# EAGLE design FdbkCtrl_v01 (EAGLE 8.2.1)

## Sheet 1 of 2
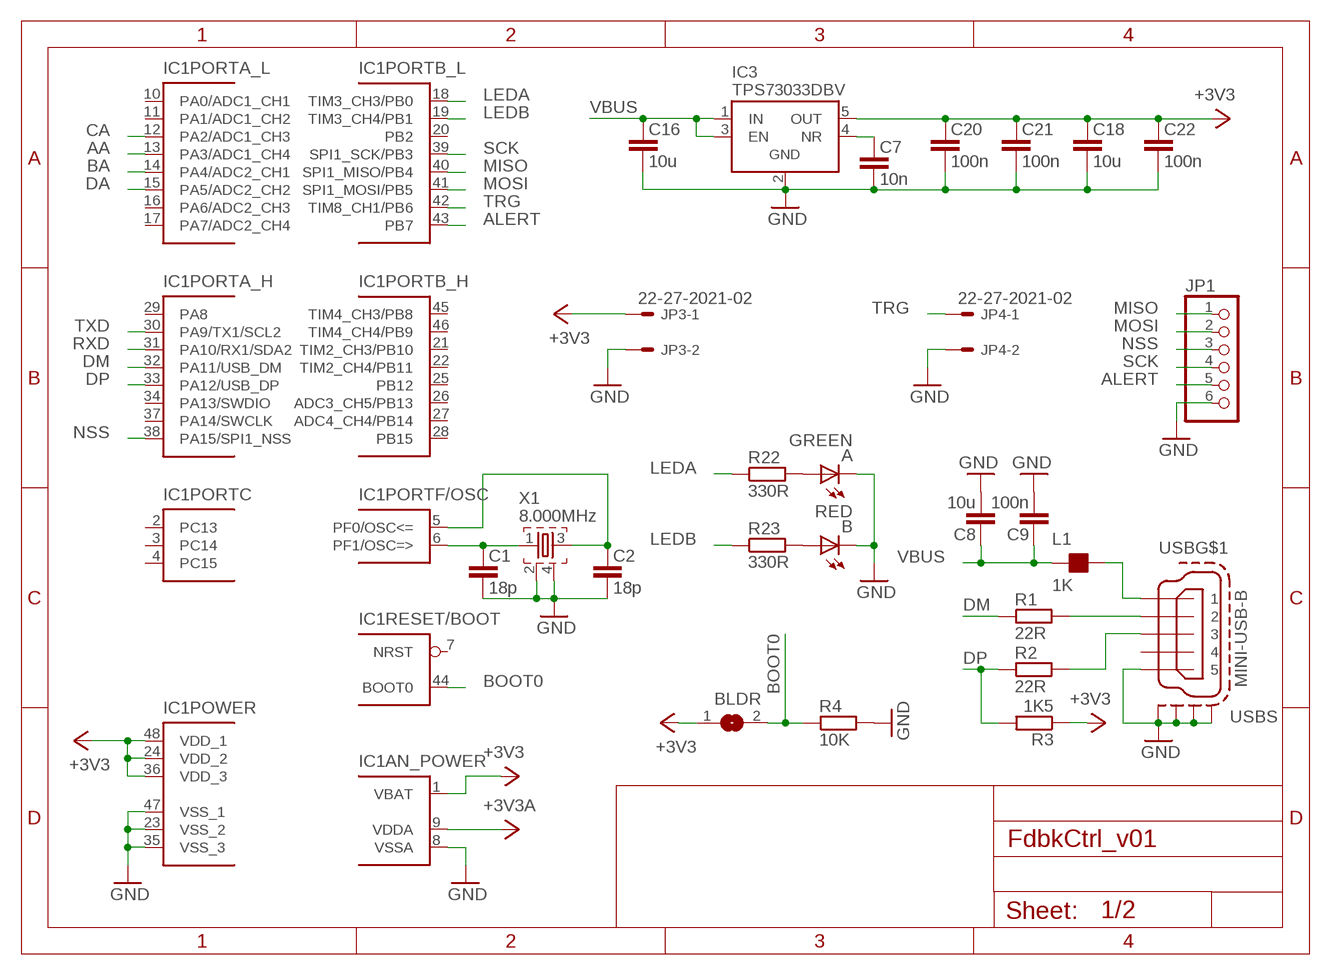
[diagram p0: schematic, sheet 1]

### Parts
A  GREEN  LEDCHIPLED_0805  [CHIPLED_0805]
B  RED  LEDCHIPLED_0805  [CHIPLED_0805]
BLDR  SJ  [SJ]
C1  18p  C_EU_C0603G  [C0603G]
C2  18p  C_EU_C0603G  [C0603G]
C7  10n  C_EU_C0402G  [C0402G]
C8  10u  C_EU_C0805G  [C0805G]
C9  100n  C_EU_C0603G  [C0603G]
C16  10u  C_EU_C0805G  [C0805G]
C18  10u  C_EU_C0805G  [C0805G]
C20  100n  C_EU_C0402G  [C0402G]
C21  100n  C_EU_C0402G  [C0402G]
C22  100n  C_EU_C0402G  [C0402G]
IC1  STM32F303CXT6  [LQFP48]
IC3  TPS73033DBV  [SOT23-5]
JP1  PINHD-1X6  [1X06]
JP3  22-27-2021-02  [6410-02]
JP4  22-27-2021-02  [6410-02]
L1  1K  FB_0603  [L0603]
R1  22R  R_EU_R0603  [R0603]
R2  22R  R_EU_R0603  [R0603]
R3  1K5  R_EU_R0603  [R0603]
R4  10K  R_EU_R0603G  [R0603G]
R22  330R  R_EU_R0603  [R0603]
R23  330R  R_EU_R0603  [R0603]
USB  MINI-USB-B  MINI-USB-SCHIELD-32005-201  [32005-201]
X1  8.000MHz  ABMM2  [ABMM2]

### Nets
+3V3: BLDR.1 C18.1 C20.1 C21.1 C22.1 IC1.1(AN_POWER:VBAT) IC1.24(POWER:VDD_2) IC1.36(POWER:VDD_3) IC1.48(POWER:VDD_1) IC3.5(OUT) JP3.1 R3.1
+3V3A: IC1.9(AN_POWER:VDDA) ; also sheet 2
AA: IC1.13(PORTA_L:PA3/ADC1_CH4) ; also sheet 2
ALERT: IC1.43(PORTB_L:PB7) JP1.5
BA: IC1.14(PORTA_L:PA4/ADC2_CH1) ; also sheet 2
BOOT0: BLDR.2 IC1.44(RESET/BOOT:BOOT0) R4.1
CA: IC1.12(PORTA_L:PA2/ADC1_CH3) ; also sheet 2
DA: IC1.15(PORTA_L:PA5/ADC2_CH2) ; also sheet 2
DM: IC1.32(PORTA_H:PA11/USB_DM) R1.1
DP: IC1.33(PORTA_H:PA12/USB_DP) R2.1 R3.2
GND: A.C B.C C1.2 C2.2 C7.2 C8.2 C9.2 C16.2 C18.2 C20.2 C21.2 C22.2 IC1.8(AN_POWER:VSSA) IC1.23(POWER:VSS_2) IC1.35(POWER:VSS_3) IC1.47(POWER:VSS_1) IC3.2(GND) JP1.6 JP3.2 JP4.2 R4.2 USB.5 USB.M1(S:S1) USB.M2(S:S2) USB.M3(S:S3) USB.M4(S:S4) X1.2 X1.4 ; also sheet 2
LEDA: IC1.18(PORTB_L:TIM3_CH3/PB0) R22.1
LEDB: IC1.19(PORTB_L:TIM3_CH4/PB1) R23.1
MISO: IC1.40(PORTB_L:SPI1_MISO/PB4) JP1.1
MOSI: IC1.41(PORTB_L:SPI1_MOSI/PB5) JP1.2
N$1: C1.1 IC1.6(PORTF/OSC:PF1/OSC=>) X1.1
N$2: C2.1 IC1.5(PORTF/OSC:PF0/OSC<=) X1.3
N$4: L1.2 USB.1
N$5: R1.2 USB.2
N$6: R2.2 USB.3
N$19: A.A R22.2
N$20: C7.1 IC3.4(NR)
N$21: B.A R23.2
NSS: IC1.38(PORTA_H:PA15/SPI1_NSS) JP1.3
RXD: IC1.31(PORTA_H:PA10/RX1/SDA2)
SCK: IC1.39(PORTB_L:SPI1_SCK/PB3) JP1.4
TRG: IC1.42(PORTB_L:TIM8_CH1/PB6) JP4.1
TXD: IC1.30(PORTA_H:PA9/TX1/SCL2)
VBUS: C8.1 C9.1 C16.1 IC3.1(IN) IC3.3(EN) L1.1 ; also sheet 2
Unconnected: IC1.2(PORTC:PC13) IC1.3(PORTC:PC14) IC1.4(PORTC:PC15) IC1.7(RESET/BOOT:NRST) IC1.10(PORTA_L:PA0/ADC1_CH1) IC1.11(PORTA_L:PA1/ADC1_CH2) IC1.16(PORTA_L:PA6/ADC2_CH3) IC1.17(PORTA_L:PA7/ADC2_CH4) IC1.20(PORTB_L:PB2) IC1.21(PORTB_H:TIM2_CH3/PB10) IC1.22(PORTB_H:TIM2_CH4/PB11) IC1.25(PORTB_H:PB12) IC1.26(PORTB_H:ADC3_CH5/PB13) IC1.27(PORTB_H:ADC4_CH4/PB14) IC1.28(PORTB_H:PB15) IC1.29(PORTA_H:PA8) IC1.34(PORTA_H:PA13/SWDIO) IC1.37(PORTA_H:PA14/SWCLK) IC1.45(PORTB_H:TIM4_CH3/PB8) IC1.46(PORTB_H:TIM4_CH4/PB9) USB.4

## Sheet 2 of 2
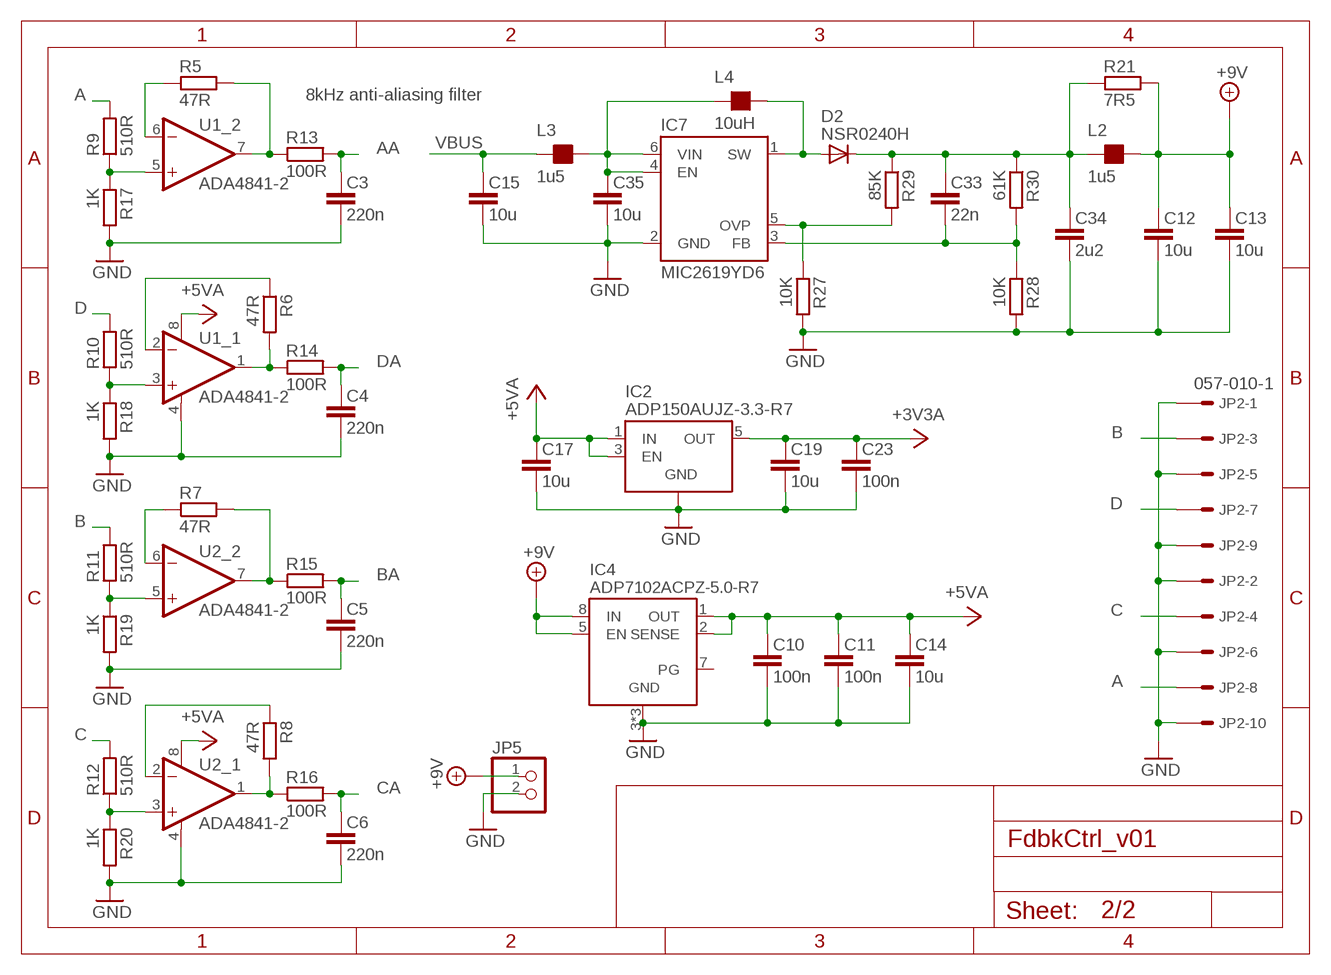
[diagram p1: schematic, sheet 2]

### Parts
C3  220n  C_EU_C0603G  [C0603G]
C4  220n  C_EU_C0603G  [C0603G]
C5  220n  C_EU_C0603G  [C0603G]
C6  220n  C_EU_C0603G  [C0603G]
C10  100n  C_EU_C0603G  [C0603G]
C11  100n  C_EU_C0603G  [C0603G]
C12  10u  C_EU_C0805G  [C0805G]
C13  10u  C_EU_C0805G  [C0805G]
C14  10u  C_EU_C0805G  [C0805G]
C15  10u  C_EU_C0805G  [C0805G]
C17  10u  C_EU_C0805G  [C0805G]
C19  10u  C_EU_C0805G  [C0805G]
C23  100n  C_EU_C0402G  [C0402G]
C33  22n  C_EU_C0603  [C0603]
C34  2u2  C_EU_C0805G  [C0805G]
C35  10u  C_EU_C0805G  [C0805G]
D2  NSR0240H  [SOD323]
IC2  ADP150AUJZ-3.3-R7  [SOT23-5]
IC4  ADP7102ACPZ-5.0-R7  [LFCSP8]
IC7  MIC2619YD6  [SOT23-6]
JP2  057-010-1  [057-010-1]
JP5  PINHD-1X2  [1X02]
L2  1u5  FB_2010  [L2010]
L3  1u5  FB_2010  [L2010]
L4  10uH  FB_1210  [L1210]
R5  47R  R_EU_R0603  [R0603]
R6  47R  R_EU_R0603  [R0603]
R7  47R  R_EU_R0603  [R0603]
R8  47R  R_EU_R0603  [R0603]
R9  510R  R_EU_R0603  [R0603]
R10  510R  R_EU_R0603  [R0603]
R11  510R  R_EU_R0603  [R0603]
R12  510R  R_EU_R0603  [R0603]
R13  100R  R_EU_R0603  [R0603]
R14  100R  R_EU_R0603  [R0603]
R15  100R  R_EU_R0603  [R0603]
R16  100R  R_EU_R0603  [R0603]
R17  1K  R_EU_R0603G  [R0603G]
R18  1K  R_EU_R0603G  [R0603G]
R19  1K  R_EU_R0603G  [R0603G]
R20  1K  R_EU_R0603G  [R0603G]
R21  7R5  R_EU_R0805  [R0805]
R27  10K  R_EU_R0603G  [R0603G]
R28  10K  R_EU_R0603G  [R0603G]
R29  85K  R_EU_R0603  [R0603]
R30  61K  R_EU_R0603  [R0603]
U1  ADA4841-2  [SOIC-8]
U2  ADA4841-2  [SOIC-8]

### Nets
+3V3A: C19.1 C23.1 IC2.5(OUT) ; also sheet 1
+5VA: C10.1 C11.1 C14.1 C17.1 IC2.1(IN) IC2.3(EN) IC4.1(OUT) IC4.2(SENSE) U1.8(_1:V+) U2.8(_1:V+)
+9V: C12.1 C13.1 IC4.5(EN) IC4.8(IN) JP5.1 L2.2 R21.2
+9VRAW: C33.1 C34.1 D2.C L2.1 R21.1 R29.1 R30.1
A: JP2.8 R9.2
AA: C3.1 R13.2 ; also sheet 1
B: JP2.3 R11.2
BA: C5.1 R15.2 ; also sheet 1
C: JP2.4 R12.2
CA: C6.1 R16.2 ; also sheet 1
D: JP2.7 R10.2
DA: C4.1 R14.2 ; also sheet 1
FB: C33.2 IC7.3(FB) R28.1 R30.2
GND: C3.2 C4.2 C5.2 C6.2 C10.2 C11.2 C12.2 C13.2 C14.2 C15.2 C17.2 C19.2 C23.2 C34.2 C35.2 IC2.2(GND) IC4.3(GND) IC4.6(GND) IC4.EP(GND) IC7.2(GND) JP2.1 JP2.2 JP2.5 JP2.6 JP2.9 JP2.10 JP5.2 R17.2 R18.2 R19.2 R20.2 R27.2 R28.2 U1.4(_1:V-) U2.4(_1:V-) ; also sheet 1
N$3: R5.2 R13.1 U1.7(_2:OUT)
N$7: R6.2 R14.1 U1.1(_1:OUT)
N$8: R7.2 R15.1 U2.7(_2:OUT)
N$9: R8.2 R16.1 U2.1(_1:OUT)
N$10: R10.1 R18.1 U1.3(_1:+IN)
N$11: R11.1 R19.1 U2.5(_2:+IN)
N$12: R12.1 R20.1 U2.3(_1:+IN)
N$13: R5.1 U1.6(_2:-IN)
N$14: R7.1 U2.6(_2:-IN)
N$15: R8.1 U2.2(_1:-IN)
N$16: R6.1 U1.2(_1:-IN)
N$17: R9.1 R17.1 U1.5(_2:+IN)
OVP: IC7.5(OVP) R27.1 R29.2
SW: D2.A IC7.1(SW) L4.2
VBUS: C15.1 L3.1 ; also sheet 1
VIN: C35.1 IC7.4(EN) IC7.6(VIN) L3.2 L4.1
Unconnected: IC4.7(PG)

### Notes on the sheet
- 8kHz anti-aliasing filter

## Library data of the parts
A B = SmartMDC:LED
BLDR = SmartMDC:SJ: SMD solder JUMPER
C1-C23 C33-C35 = SmartMDC:C_EU_
D2 = SmartMDC:NSR0240H
IC1 = SmartMDC:STM32F303CXT6: ST STM32F101/103 48pin LQFP
IC2 = SmartMDC:ADP150*: ANALOG DEVICES Ultralow Noise, 150 mA CMOS Linear Regulator
IC3 = SmartMDC:TPS730*: TEXAS INSTRUMENTS Low-Noise, High PSRR, RF, 200-mA Low-Dropout Linear Regulators
IC4 = SmartMDC:ADP7102*: ANALOG DEVICES 20 V, 300 mA, Low Noise, CMOS LDO
IC7 = SmartMDC:MIC2619
JP1 = SmartMDC:PINHD-1X6: PIN HEADER
JP2 = con-panduit:057-010-: CONNECTOR 10-pin series 057 contact pc board low profile headers; OC_FARNELL: unknown; OC_NEWARK: unknown
JP3 JP4 = SmartMDC:22-?-02: CONNECTOR wire to board 2.54 mm (.1 inch) pitch header; OC_FARNELL: unknown; OC_NEWARK: unknown
JP5 = SmartMDC:PINHD-1X2: PIN HEADER
L1-L4 = SmartMDC:FB_: FERRITE BEAD
R1-R23 R27-R30 = SmartMDC:R_EU_
U1 U2 = SmartMDC:ADA4841
USB = SmartMDC:MINI-USB-SCHIELD-: MINI USB-B Conector Source: www.cypressindustries.com; OC_FARNELL: unknown; OC_NEWARK: unknown
X1 = SmartMDC:ABM

## Board
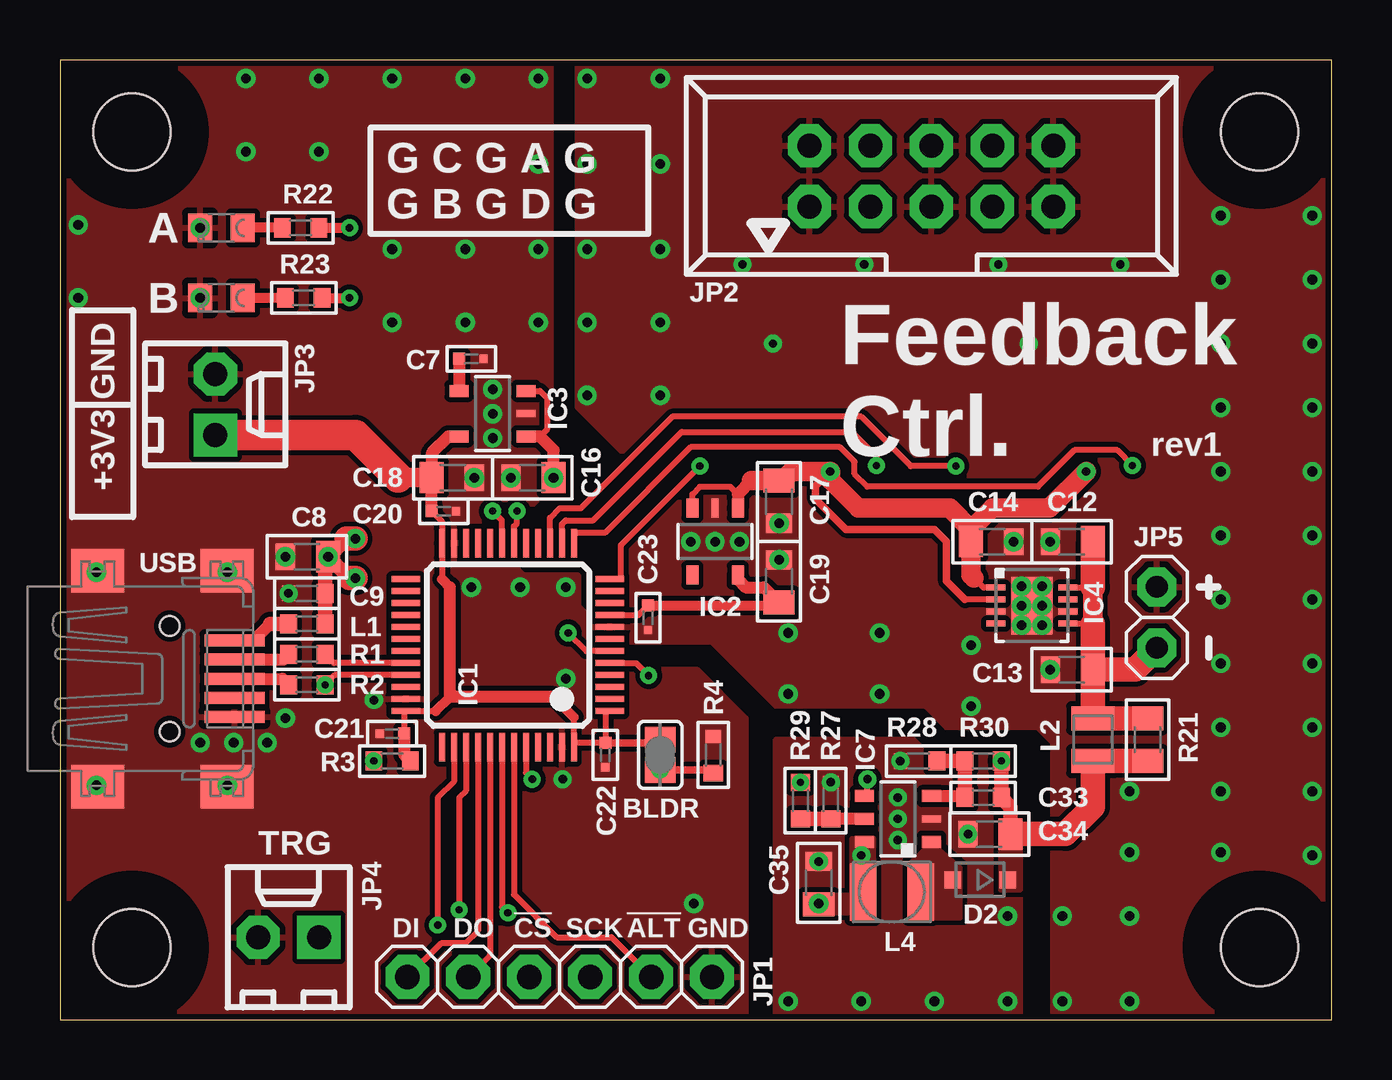
[diagram p2: board, top side]
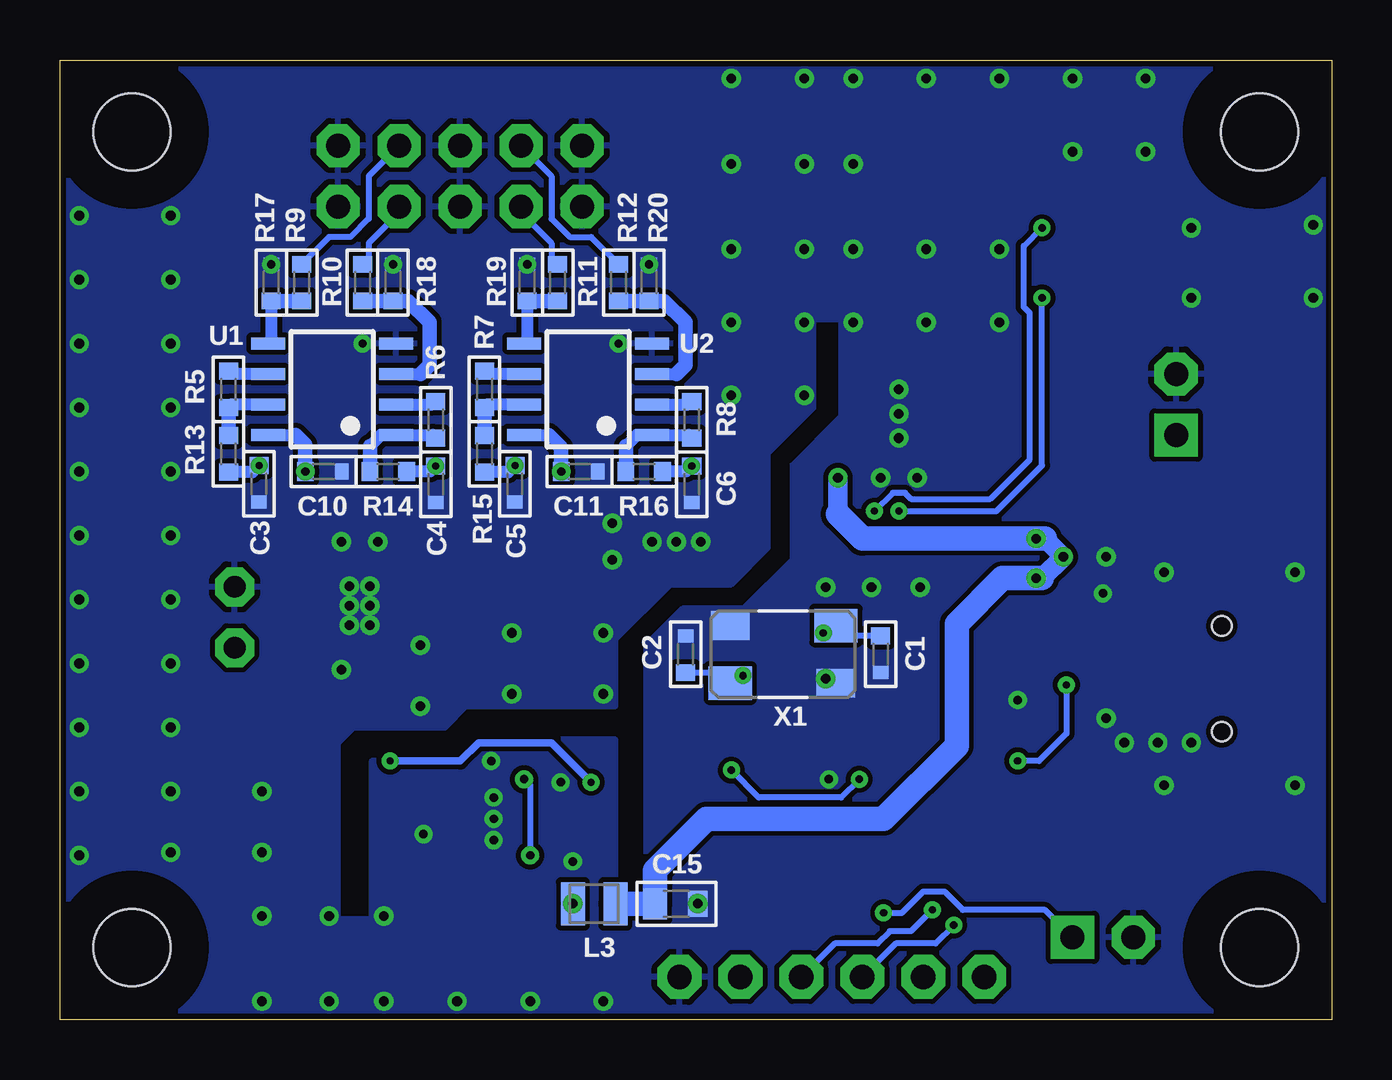
[diagram p3: board, bottom side, seen from below]

Size 53 x 40 mm. Coordinates in mm from the lower left corner, seen from the top.
Outline: 0,0 53,0 53,40 0,40 0,0
Copper layers (1*16): Top 0.035mm / dielectric 1.5mm / Bottom 0.035mm
Design rules "default *": minimum track width 8mil, minimum drill 0.3mm, track to track 8mil, track to pad 8mil, pad to pad 8mil, via to via 8mil, smd to smd 0mil, copper to edge 10mil, drill to drill 6mil, minimum pad ring 10mil, minimum via ring 8mil, stop-mask expansion 4mil, vias tented up to drill 24mil, thermal gap 10mil
Holes 3.2 mm at 3,3 50,3 3,37 50,37
tRestrict: area 0,34 to 6,40; area 0,0 to 6,6; area 47,0 to 53,6; area 47,34 to 53,40
bRestrict: area 47,34 to 53,40; area 0,34 to 6,40; area 0,0 to 6,6; area 47,0 to 53,6

### Footprints (pad centres in the part's own frame; a part is rotated, then mirrored left to right if it is on the bottom)
CHIPLED_0805 = smd 1.2 x 1: A 0,-0.889; C 0,0.889
SJ = smd 1.067 x 1.27: 1 -0.635,0; 2 0.635,0
C0603G = smd 0.7 x 0.8: 1 -0.762,0 | smd 0.548 x 0.648: 2 0.762,0
C0402G = smd 0.5 x 0.5: 1 -0.508,0 | smd 0.348 x 0.348: 2 0.508,0
C0805G = smd 1 x 1.3: 1 -0.889,0 | smd 0.797 x 1.097: 2 0.889,0
C0603 = smd 0.7 x 0.8: 1 -0.762,0; 2 0.762,0
SOD323 = smd 0.7 x 0.7: A 1.143,0; C -1.143,0
LQFP48 = smd 0.25 x 1.2: 1 -2.75,-4.25; 2 -2.25,-4.25; 3 -1.75,-4.25; 4 -1.25,-4.25; 5 -0.75,-4.25; 6 -0.25,-4.25; 7 0.25,-4.25; 8 0.75,-4.25; 9 1.25,-4.25; 10 1.75,-4.25; 11 2.25,-4.25; 12 2.75,-4.25; 25 2.75,4.25; 26 2.25,4.25; 27 1.75,4.25; 28 1.25,4.25; 29 0.75,4.25; 30 0.25,4.25; 31 -0.25,4.25; 32 -0.75,4.25; 33 -1.25,4.25; 34 -1.75,4.25; 35 -2.25,4.25; 36 -2.75,4.25 | smd 1.2 x 0.25: 13 4.25,-2.75; 14 4.25,-2.25; 15 4.25,-1.75; 16 4.25,-1.25; 17 4.25,-0.75; 18 4.25,-0.25; 19 4.25,0.25; 20 4.25,0.75; 21 4.25,1.25; 22 4.25,1.75; 23 4.25,2.25; 24 4.25,2.75; 37 -4.25,2.75; 38 -4.25,2.25; 39 -4.25,1.75; 40 -4.25,1.25; 41 -4.25,0.75; 42 -4.25,0.25; 43 -4.25,-0.25; 44 -4.25,-0.75; 45 -4.25,-1.25; 46 -4.25,-1.75; 47 -4.25,-2.25; 48 -4.25,-2.75
SOT23-5 = smd 0.5 x 0.8: 1 -0.95,-1.397; 3 0.95,-1.397; 4 0.95,1.397; 5 -0.95,1.397 | smd 0.297 x 0.8: 2 0,-1.397
LFCSP8 = smd 0.25 x 0.8: 1 -0.75,-1.5; 2 -0.25,-1.5; 3 0.25,-1.5; 4 0.75,-1.5; 5 0.75,1.5; 6 0.25,1.5; 7 -0.25,1.5; 8 -0.75,1.5 | smd 2.4 x 1.7: EP 0,0
SOT23-6 = smd 0.5 x 0.8: 1 -0.95,-1.397; 3 0.95,-1.397; 4 0.95,1.397; 5 0,1.397; 6 -0.95,1.397 | smd 0.297 x 0.8: 2 0,-1.397
1X06 = drill 1.016 octagon: 1 -6.35,0; 2 -3.81,0; 3 -1.27,0; 4 1.27,0; 5 3.81,0; 6 6.35,0
057-010-1 = drill 1 octagon: 1 -5.08,-1.27; 2 -5.08,1.27; 3 -2.54,-1.27; 4 -2.54,1.27; 5 0,-1.27; 6 0,1.27; 7 2.54,-1.27; 8 2.54,1.27; 9 5.08,-1.27; 10 5.08,1.27
6410-02 = drill 1 square: 1 1.27,0 | drill 1 octagon: 2 -1.27,0
1X02 = drill 0.9 octagon: 1 -1.27,0; 2 1.27,0
L0603 = smd 0.7 x 0.8: 1 -0.762,0; 2 0.762,0
L2010 = smd 1 x 1.8: 1 -0.889,0; 2 0.889,0
L1210 = smd 1.1 x 2.4: 1 -1.2,0; 2 1.2,0
R0603 = smd 0.7 x 0.8: 1 -0.762,0; 2 0.762,0
R0603G = smd 0.7 x 0.8: 1 -0.762,0 | smd 0.548 x 0.648: 2 0.762,0
R0805 = smd 1 x 1.3: 1 -0.889,0; 2 0.889,0
SOIC-8 = smd 0.5 x 1.4: 1 -1.905,-2.667; 2 -0.635,-2.667; 3 0.635,-2.667; 4 1.905,-2.667; 5 1.905,2.667; 6 0.635,2.667; 7 -0.635,2.667; 8 -1.905,2.667
32005-201 = smd 2.5 x 0.5: 1 2.7,1.6; 2 2.7,0.8; 3 2.7,0; 4 2.7,-0.8; 5 2.7,-1.6 | smd 2.2 x 1.8: M1 -3,-4.5; M2 -3,4.5; M3 2.4,4.5; M4 2.4,-4.5 | hole 0.8: 0,2.2; 0,-2.2
ABMM2 = smd 1.8 x 1.4: 1 -2.2,-1.2; 3 2.2,1.2 | smd 1.597 x 1.197: 2 2.2,-1.2; 4 -2.2,1.2

### Placement (x,y rotation side)
A  6.73,33 90 top
B  6.73,30.08 90 top
BLDR  25.02,11.03 270 top
C1  18.8,15.22 270 bottom
C2  26.92,15.22 90 bottom
C3  44.7,22.34 270 bottom
C4  37.34,22.31 270 bottom
C5  34.04,22.34 270 bottom
C6  26.67,22.31 270 bottom
C7  17.14,27.54 0 top
C8  10.29,19.29 180 top
C9  10.29,17.76 180 top
C10  42.01,22.84 0 bottom
C11  31.34,22.84 0 bottom
C12  42.16,19.92 180 top
C13  42.16,14.59 180 top
C14  38.86,19.92 0 top
C15  27.3,4.83 0 bottom
C16  19.68,22.59 180 top
C17  29.97,21.57 270 top
C18  16.38,22.59 0 top
C19  29.97,18.27 90 top
C20  16,21.19 0 top
C21  13.84,11.92 180 top
C22  22.73,11.03 270 top
C23  24.51,16.75 270 top
C33  38.48,9.26 180 top
C34  38.73,7.73 180 top
C35  31.62,5.7 90 top
D2  38.35,5.83 180 top
IC1  18.67,15.61 90 top
IC2  27.3,19.92 180 top
IC3  18.03,25.26 90 top
IC4  40.51,17.26 270 top
IC7  34.92,8.37 90 top
JP1  20.83,1.78 0 top
JP2  36.32,35.16 0 top
JP3  6.48,25.64 270 top
JP4  9.53,3.43 0 top
JP5  45.72,16.76 90 top
L1  10.29,16.49 180 top
L2  43.05,11.67 90 top
L3  30.73,4.83 180 bottom
L4  34.67,5.32 0 top
R1  10.29,15.22 180 top
R2  10.29,13.95 180 top
R3  13.84,10.78 180 top
R4  27.23,11.03 90 top
R5  45.97,26.27 270 bottom
R6  37.34,25 270 bottom
R7  35.31,26.27 270 bottom
R8  26.67,25 270 bottom
R9  42.93,30.72 90 bottom
R10  40.39,30.72 90 bottom
R11  32.26,30.72 90 bottom
R12  29.72,30.72 90 bottom
R13  45.97,23.58 270 bottom
R14  39.32,22.84 0 bottom
R15  35.31,23.58 270 bottom
R16  28.65,22.84 0 bottom
R17  44.2,30.72 90 bottom
R18  39.12,30.72 90 bottom
R19  33.53,30.72 90 bottom
R20  28.45,30.72 90 bottom
R21  45.34,11.67 90 top
R22  10.03,33 180 top
R23  10.16,30.08 180 top
R27  32.13,9.13 90 top
R28  35.79,10.78 180 top
R29  30.86,9.13 270 top
R30  38.48,10.78 180 top
U1  41.66,26.27 90 bottom
U2  30.99,26.27 90 bottom
USB  4.57,14.21 0 top
X1  22.86,15.22 180 bottom

### Tracks (layer width: path | path; a pad name or v marks a point on that pad's centre or on a via)
+3V3
  Top 0.254: C21.1 14.35,12.86 IC1.36 15.66,12.86 | IC1.1 22.73,12.86 C22.1 21.42,11.54 IC1.48 21.42,12.6 | C20.1 15.92,20.77 IC1.24 15.92,18.36
  Top 0.305: C22.1 24.89,11.54 BLDR.1
  Top 0.406: 15.92,18.36 16.26,18.02 | 15.66,12.86 16.26,13.45 | 21.42,12.6 20.57,13.45
  Top 0.508: C21.1 14.35,11.03 R3.1 | C20.1 C18.1 15.49,23.61 16.2,24.31 IC3.5 | 16.26,18.02 16.26,13.45 20.57,13.45
  Top 0.813: C18.1 14.1,22.59
  Top 1.27: JP3.1 12.32,24.37 14.1,22.59
+3V3A
  Top 0.254: IC1.9 24.11,16.86 C23.1
  Top 0.406: C23.1 29.84,17.26 C19.1
  Top 0.508: IC2.5 28.25,18.34 28.57,18.02 29.34,18.02 C19.1
+5VA  (via drill 0.35)
  Top 0.254: IC4.1 38.49,18.01 38.1,18.4 | IC4.2 37.72,17.51 | IC2.3 26.36,21.89 26.67,22.21 27.93,22.21 28.25,21.89
  Top 0.305: 37.72,17.51 36.96,18.27 36.96,19.92 36.45,20.43 32.77,20.43 31.5,21.7 31.5,22.23 C11.1
  Top 0.508: IC2.1 28.25,21.89 28.83,22.46
  Top 0.813: C10.1 41.25,21.32 38.86,21.32 37.97,20.43 | 38.1,18.4 37.97,18.53 C14.1 37.97,20.43 | 37.97,20.43 37.08,21.32 33.27,21.32 32.11,22.49 C11.1 30.48,22.84 30.1,22.46 C17.1 28.83,22.46
  Bottom 0.508: U2.8 32.64,24.37 | U1.8 43.18,24.37
  Bottom 0.61: 32.64,24.37 32.11,23.84 C11.1 | 43.18,24.37 42.77,23.96 C10.1
  other vias: 32.11,22.84 42.77,22.84
+9V
  Top 0.254: IC4.8 43.04,18.01 | IC4.5 43.04,16.51
  Top 0.305: 43.04,18.01 43.05,18.02 | 43.04,16.51 43.05,16.49
  Top 0.813: 43.05,16.49 43.05,18.02
  Top 1.016: 43.05,16.49 C13.1 | 43.05,18.02 C12.1 | C13.1 L2.2 R21.2 | C13.1 44.81,14.59 JP5.1
+9VRAW  (via drill 0.3)
  Top 0.61: R30.1 C33.1 39.62,8.87 C34.1
  Top 1.016: R21.1 L2.1 43.05,8.87 41.91,7.73 C34.1
  Bottom 0.305: R29.1 32.51,11.54 35.56,11.54 36.32,10.78 R30.1
  other vias: 30.86,9.89 39.24,10.78
  pour Top (isolate 0.203, no thermals): 39.22,8.29 40.03,8.29 40.03,5.39 39.22,5.39
A
  Bottom 0.254: JP2.8 40.13,35.16 40.13,33.38 40.89,32.62 41.78,32.62 R9.2
AA  (via drill 0.3)
  Top 0.254: C3.1 44.07,23.73 42.29,23.73 40.77,22.21 33.66,22.21 33.12,22.74 33.12,23.25 32.51,23.86 26.29,23.86 22.73,20.3 21.42,20.3 IC1.13
  Bottom 0.508: C3.1 44.98,22.82 R13.2
  other vias: 44.7,23.1
ALERT
  Top 0.254: IC1.43 18.92,5.21 20.7,3.43 22.99,3.43 JP1.5
B
  Bottom 0.254: JP2.3 33.78,33.64 32.51,32.37 32.51,31.73 R11.2
BA  (via drill 0.3)
  Top 0.254: IC1.14 20.92,20.65 21.08,20.81 22.23,20.81 25.91,24.5 33.02,24.5 34.04,23.48 C5.1
  Bottom 0.508: C5.1 34.31,22.82 R15.2
  other vias: 34.04,23.1
BOOT0  (via drill 0.3)
  Top 0.254: IC1.44 19.42,10.28 v19.68,10.02
  Top 0.305: BLDR.2 27.1,10.4 R4.1
  Bottom 0.254: v19.68,10.02 20.45,9.26 23.88,9.26 BLDR.2 25.04,10.4
  other vias: 25.02,10.4
C
  Bottom 0.254: JP2.4 32.51,35.16 32.51,33.38 31.75,32.62 30.86,32.62 R12.2
CA  (via drill 0.3)
  Top 0.254: IC1.12 23.37,18.36 23.37,19.77 C6.1
  Bottom 0.508: C6.1 26.9,22.84 R16.2
  other vias: 26.67,23.07
D
  Bottom 0.254: JP2.7 38.86,33.64 40.13,32.37 40.13,31.73 R10.2
DA  (via drill 0.3)
  Top 0.254: IC1.15 20.42,20.91 20.83,21.32 21.72,21.32 25.53,25.13 33.4,25.13 35.46,23.07 C4.1
  Bottom 0.508: C4.1 37.57,22.84 R14.2
  other vias: 37.34,23.07
DM
  Top 0.254: IC1.32 11.42,14.86 R1.1
DP  (via drill 0.3)
  Top 0.254: IC1.33 11.45,14.36 R2.1
  Bottom 0.254: R2.1 11.05,11.92 12.19,10.78 R3.2
  other vias: 13.08,10.78 11.05,13.95
FB
  Top 0.508: IC7.3 37.66,9.32 C33.2
  Top 0.61: R28.1 R30.2 C33.2
GND  (via drill 0.35, 0.4)
  other vias: 28.45,31.48 33.53,31.48 44.2,31.48 39.12,31.48 29.72,28.18 40.39,28.18 37.85,7.73 34.92,8.37 35.03,10.78 32.13,9.89 34.92,9.26 34.92,7.48 31.62,6.59 41.27,19.92 41.27,14.59 40.08,17.26 39.75,19.92 40.08,18.07 40.94,18.07 40.08,16.44 40.94,16.44 40.94,17.26 18.8,22.59 17.27,22.59 18.03,25.26 29.97,19.16 29.97,20.68 13.08,13.32 20.95,10.02 27.3,19.92 9.4,19.29 9.53,17.76 30.35,0.76 33.4,0.76 36.45,0.76 39.5,0.76 7.24,11.54 8.64,11.54 9.4,12.56 5.84,11.54 30.35,13.57 30.35,16.11 34.16,13.57 37.97,13.06 34.16,16.11 37.97,15.61 41.78,0.76 41.78,4.32 44.58,0.76 52.2,9.51 52.2,6.84 52.2,12.18 52.2,14.84 52.2,17.51 52.2,20.18 52.2,22.84 52.2,25.51 52.2,28.18 52.2,30.84 52.2,33.51 48.39,9.51 48.39,12.18 48.39,14.84 48.39,17.51 48.39,20.18 48.39,22.84 48.39,25.51 48.39,28.18 48.39,30.84 48.39,33.51 44.58,4.32 44.58,9.51 21.97,32.12 21.97,29.07 21.97,26.02 25.02,32.12 25.02,29.07 25.02,26.02 21.97,39.23 25.02,39.23 19.94,39.23 19.94,32.12 19.94,29.07 18.03,26.27 18.03,24.24 28.32,19.92 26.29,19.92 19.94,35.67 21.97,35.67 25.02,35.67 16.89,39.23 13.84,39.23 10.79,39.23 7.75,39.23 10.79,36.18 7.75,36.18 0.76,33.13 0.76,30.08 16.89,32.12 13.84,32.12 13.84,29.07 16.89,29.07 5.84,33 5.84,30.08 1.52,18.65 6.99,18.65 1.52,9.76 6.99,9.76 21.08,18.02 19.18,18.02 17.14,18.02 21.08,14.21 48.39,6.97 44.58,6.97 26.42,4.83 39.5,4.32
  pour Bottom (isolate 0.203, rank 6): 0,0 0,40 53,40 53,0 41.4,0 41.4,11.54 40.77,12.18 36.96,12.18 36.07,13.06 29.84,13.06 29.84,15.86 27.56,18.14 25.02,18.14 23.5,19.67 23.5,23.61 21.59,25.51 21.59,29.19 20.45,29.19 20.45,25.13 22.48,23.1 22.48,19.16 24.51,17.13 27.05,17.13 28.57,15.61 28.57,4.81 29.84,4.81 29.84,0
  pour Top (isolate 0.203, rank 6): 0,0 0,40 20.45,40 20.45,22.21 18.92,20.68 18.92,18.91 19.3,18.53 21.59,18.53 21.59,17.26 22.1,16.75 22.1,19.16 22.61,19.67 23.5,19.67 23.5,23.61 21.59,25.51 21.59,40 53,40 53,0 41.4,0 41.4,11.54 40.77,12.18 36.96,12.18 36.07,13.06 29.84,13.06 27.18,15.73 23.37,15.73 23.37,14.59 26.54,14.59 28.57,12.56 28.57,0
  pour Top (isolate 0.203, rank 6): 29.84,0 29.84,11.67 35.56,11.67 36.2,11.03 40.01,11.03 40.01,0
  pour Bottom (isolate 0.203, rank 6): 29.84,0 29.84,11.67 35.56,11.67 36.45,10.78 40.01,10.78 40.01,4.17 41.4,4.17 41.4,0
LEDA  (via drill 0.3)
  Top 0.254: IC1.18 18.92,20.55 19.05,20.68 v19.05,21.19
  Top 0.406: R22.1 v12.06,33
  Bottom 0.254: v12.06,33 12.83,32.24 12.83,29.7 12.57,29.45 12.57,23.35 14.22,21.7 17.53,21.7 17.78,21.95 18.29,21.95 v19.05,21.19
LEDB  (via drill 0.3)
  Top 0.254: IC1.19 18.42,20.81 v18.03,21.19
  Top 0.406: R23.1 v12.06,30.08
  Bottom 0.254: v18.03,21.19 13.97,21.19 12.06,23.1 v12.06,30.08
MISO
  Top 0.254: JP1.1 15.88,3.17 16.89,3.17 17.42,3.7 IC1.40
MOSI
  Top 0.254: IC1.41 17.92,2.68 JP1.2
N$1  (via drill 0.3)
  Top 0.254: IC1.6 21.94,15.36 v21.18,16.11
  Bottom 0.254: C1.1 20.22,15.99 X1.1 20.87,16.42 v21.18,16.11
N$2  (via drill 0.3)
  Top 0.254: IC1.5 24.02,14.86 v24.54,14.34
  Bottom 0.254: C2.1 25.5,14.46 X1.3 24.85,14.02 v24.54,14.34
N$3
  Bottom 0.508: U1.7 45.85,25.64 R5.2
  Bottom 0.61: R5.2 R13.1
N$4
  Top 0.508: USB.1 8.08,15.81 8.76,16.49
  Top 0.61: 8.76,16.49 L1.2
N$5
  Top 0.508: USB.2 9.31,15.01 R1.2
N$6
  Top 0.508: USB.3 9.27,14.21 R2.2
N$7
  Bottom 0.508: R6.2 37.47,24.37 U1.1 39.62,24.37 40.08,23.91
  Bottom 0.61: R14.1 40.08,23.91
N$8
  Bottom 0.508: U2.7 35.18,25.64 R7.2
  Bottom 0.61: R7.2 R15.1
N$9
  Bottom 0.508: R8.2 26.8,24.37 U2.1 28.96,24.37 29.41,23.91
  Bottom 0.61: R16.1 29.41,23.91
N$10
  Bottom 0.508: U1.3 37.97,26.91
  Bottom 0.61: R10.1 R18.1 38.48,29.96 37.59,29.07 37.59,27.29 37.97,26.91
N$11
  Bottom 0.508: R19.1 33.53,28.18 U2.5
  Bottom 0.61: R11.1 R19.1
N$12
  Bottom 0.508: U2.3 27.3,26.91
  Bottom 0.61: R12.1 R20.1 27.81,29.96 26.92,29.07 26.92,27.29 27.3,26.91
N$13
  Bottom 0.508: U1.6 45.85,26.91 R5.1
N$14
  Bottom 0.508: U2.6 35.18,26.91 R7.1
N$15
  Bottom 0.508: U2.2 26.8,25.64 R8.1
N$16
  Bottom 0.508: U1.2 37.47,25.64 R6.1
N$17
  Bottom 0.508: R17.1 44.2,28.18 U1.5
  Bottom 0.61: R9.1 R17.1
N$19
  Top 0.406: R22.2 A.A
N$20
  Top 0.508: C7.1 IC3.4
N$21
  Top 0.406: R23.2 B.A
NSS  (via drill 0.3)
  Top 0.254: IC1.38 16.42,9.93 15.75,9.26 v15.75,3.94
  Bottom 0.254: v15.75,3.94 16.51,3.17 18.16,3.17 JP1.3
OVP
  Top 0.508: IC7.5 R27.1
  Top 0.61: R27.1 R29.2
SCK  (via drill 0.3)
  Top 0.254: IC1.39 16.92,9.54 16.64,9.26 v16.64,4.57
  Bottom 0.254: v16.64,4.57 17.53,3.68 18.41,3.68 18.92,3.17 20.7,3.17 JP1.4
SW
  pour Top (isolate 0.203, no thermals): 36.63,7.48 36.63,7.1 37.52,6.33 37.52,4.23 35.43,4.23 35.43,6.51 36.04,7.12 36.04,7.48
TRG  (via drill 0.3)
  Top 0.254: v18.67,4.45 18.42,4.7 IC1.42
  Bottom 0.254: JP4.1 11.94,4.57 15.37,4.57 16.13,5.33 17.02,5.33 17.91,4.45 v18.67,4.45
VBUS  (via drill 0.4)
  Top 0.254: IC3.3 20,26.21 20.32,25.89 20.32,24.62 20,24.31
  Top 0.508: C16.1 20.57,23.74 20,24.31 IC3.1
  Top 0.61: L1.1 C9.1 11.05,19.16 C8.1 | C8.1 11.94,20.05 | C8.1 12.06,18.4
  Top 1.016: 11.94,20.05 v12.32,20.05 | 12.06,18.4 v12.32,18.4
  Bottom 0.813: 20.57,21.07 C16.1 | 11.94,20.05 C8.1 12.06,18.4
  Bottom 1.016: 20.57,21.07 19.56,20.05 11.94,20.05 | 12.06,18.4 13.72,18.4 15.62,16.49 15.62,11.41 18.67,8.37 26.05,8.37 28.19,6.22 C15.1 L3.1
  other vias: 20.57,22.59 11.18,19.29
VIN  (via drill 0.35, 0.4)
  Top 0.254: IC7.4 33.66,9.32 v33.66,10.02
  Bottom 0.254: v33.66,10.02 33.4,9.76 v33.4,6.84
  other vias: 31.62,4.83
  pour Top (isolate 0.203, no thermals): 33.02,7.55 33.91,7.55 33.91,4.43 31.11,4.43 31.11,5.19 33.02,5.19

### Text on the board
tPlace: G C G A G / G B G D G | +3V3 GND | Feedback / Ctrl. | rev1 | TRG | DI | DO | !CS | SCK | !ALT | GND
_tNames: A | R22 | B | R23 | JP2 | JP3 | C7 | IC3 | C16 | C17 | C18 | C8 | C20 | C14 | C12 | JP5 | USB | C19 | C23 | IC2 | IC4 | C9 | L1 | R1 | C13 | R2 | C21 | IC1 | R4 | R21 | IC7 | R28 | R30 | R3 | R29 | R27 | L2 | C22 | BLDR | C33 | JP4 | C34 | C35 | D2 | L4 | JP1
_bNames: R20 | R12 | R9 | R17 | R11 | R19 | R18 | R10 | U1 | U2 | R7 | R6 | R8 | R5 | C6 | R13 | R16 | C11 | R15 | R14 | C10 | C5 | C4 | C3 | C1 | C2 | X1 | C15 | L3